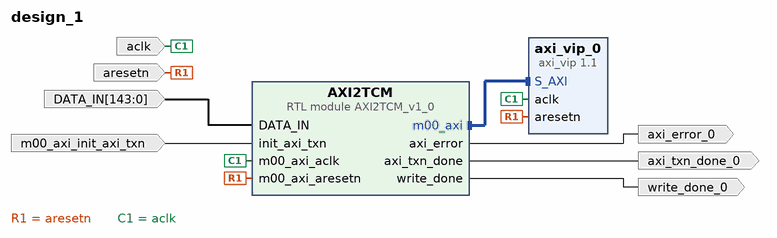
[diagram p0: block diagram of the top level]
# Vivado block design design_1, xczu9eg-ffvb1156-2-e, Vivado 2017.4
create_bd_design design_1

create_bd_port -dir I -type rst aresetn
create_bd_port -dir I -type clk aclk
set_property -dict {CONFIG.ASSOCIATED_RESET aresetn} [get_bd_ports aclk]
create_bd_port -dir I m00_axi_init_axi_txn
create_bd_port -dir I -from 143 -to 0 DATA_IN
create_bd_port -dir O write_done_0
create_bd_port -dir O axi_txn_done_0
create_bd_port -dir O axi_error_0

create_bd_cell -type ip -vlnv xilinx.com:ip:axi_vip:1.1 axi_vip_0
set_property -dict {CONFIG.INTERFACE_MODE SLAVE} [get_bd_cells axi_vip_0]
create_bd_cell -type module -reference AXI2TCM_v1_0 AXI2TCM
set_property -dict [list \
  CONFIG.C_M00_NUMBER_of_ADCs 9 \
  CONFIG.C_M00_AXI_AWUSER_WIDTH 1 \
  CONFIG.C_M00_AXI_ARUSER_WIDTH 1 \
  CONFIG.C_M00_AXI_WUSER_WIDTH 1 \
  CONFIG.C_M00_AXI_RUSER_WIDTH 1 \
  CONFIG.C_M00_AXI_BUSER_WIDTH 1 \
] [get_bd_cells AXI2TCM]

# ---- connections ----

connect_bd_intf_net -intf_net AXI2TCM_v1_0_0_m00_axi [get_bd_intf_pins AXI2TCM/m00_axi] [get_bd_intf_pins axi_vip_0/S_AXI]
connect_bd_net -net aresetn_0_1 [get_bd_ports aresetn] [get_bd_pins axi_vip_0/aresetn] [get_bd_pins AXI2TCM/m00_axi_aresetn]
connect_bd_net -net aclk_0_1 [get_bd_ports aclk] [get_bd_pins axi_vip_0/aclk] [get_bd_pins AXI2TCM/m00_axi_aclk]
connect_bd_net [get_bd_ports DATA_IN] [get_bd_pins AXI2TCM/DATA_IN]
connect_bd_net [get_bd_ports m00_axi_init_axi_txn] [get_bd_pins AXI2TCM/init_axi_txn]
connect_bd_net -net AXI2TCM_v1_0_0_write_done [get_bd_pins AXI2TCM/write_done] [get_bd_ports write_done_0]
connect_bd_net -net AXI2TCM_v1_0_0_axi_txn_done [get_bd_pins AXI2TCM/axi_txn_done] [get_bd_ports axi_txn_done_0]
connect_bd_net -net AXI2TCM_v1_0_0_axi_error [get_bd_pins AXI2TCM/axi_error] [get_bd_ports axi_error_0]

# ---- address map ----
assign_bd_address -offset 0x44A00000 -range 64K -target_address_space [get_bd_addr_spaces AXI2TCM/m00_axi] [get_bd_addr_segs axi_vip_0/S_AXI/Reg]

validate_bd_design
save_bd_design
